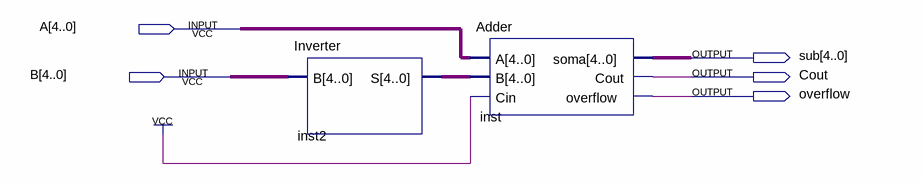
[diagram p0: schematic sheet]
// Quartus schematic Subtrator.bdf as structural Verilog: 2 symbols, 5 pins
module Subtrator (
  input  [4:0] A,
  input  [4:0] B,
  output [4:0] sub,
  output Cout,
  output overflow
);

  wire [4:0] inst2_s;

  Inverter inst2 (.B(B), .S(inst2_s));
  Adder inst (.A(A), .B(inst2_s), .Cin(1'b1), .soma(sub), .Cout(Cout), .overflow(overflow));
endmodule
